# EAGLE schematic esp12_led (EAGLE 7.2.0)
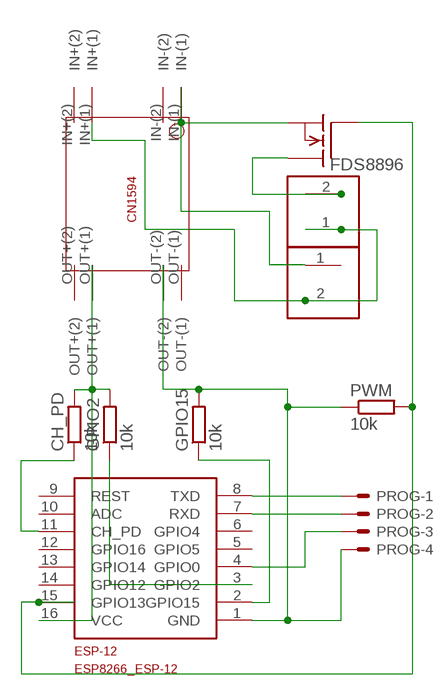
[diagram p0: schematic, sheet 1]

## Parts
12V_IN  KF350-P2  [KF350-2P]
CH_PD  10k  R-EU_R0603  [R0603]
DC_CONVERTER  CN1594THROUGH-HOLE  [CN1594]
ESP-12  ESP8266_ESP-12  [ESP8266-ESP12]
FDS8896  FDS5680  [SO-8]
GPIO2  10k  R-EU_R0603  [R0603]
GPIO15  10k  R-EU_R0603  [R0603]
LED  KF350-P2  [KF350-2P]
PROG  87438-04  [87438-04]
PWM  10k  R-EU_R0603  [R0603]

## Nets
N$1: CH_PD.2 DC_CONVERTER.OUT+(1) ESP-12.16(VCC) GPIO2.2
N$2: CH_PD.1 ESP-12.11(CH_PD)
N$3: ESP-12.3(GPIO2) GPIO2.1
N$4: FDS8896.5(D) FDS8896.6(D) FDS8896.7(D) FDS8896.8(D) LED.2
N$5: ESP-12.8(TXD) PROG.1
N$6: DC_CONVERTER.OUT-(2) ESP-12.1(GND) GPIO15.2 PROG.4 PWM.1
N$7: ESP-12.2(GPIO15) GPIO15.1
N$8: ESP-12.7(RXD) PROG.2
N$9: ESP-12.4(GPIO0) PROG.3
N$10: 12V_IN.1 DC_CONVERTER.IN-(1) FDS8896.1(S) FDS8896.2(S) FDS8896.3(S)
N$12: 12V_IN.2 DC_CONVERTER.IN+(1) LED.1
N$13: ESP-12.15(GPIO13) FDS8896.4(G) PWM.2
Unconnected: DC_CONVERTER.IN+(2) DC_CONVERTER.IN-(2) DC_CONVERTER.OUT+(2) DC_CONVERTER.OUT-(1) ESP-12.5(GPIO5) ESP-12.6(GPIO4) ESP-12.9(REST) ESP-12.10(ADC) ESP-12.12(GPIO16) ESP-12.13(GPIO14) ESP-12.14(GPIO12)

## Library data of the parts
12V_IN LED = KF350-P2:KF350-P2
CH_PD GPIO2 GPIO15 PWM = rcl:R-EU_: RESISTOR, European symbol
DC_CONVERTER = CN1594_smd:CN1594
ESP-12 = ESP8266-ESP12:ESP8266_ESP-12
FDS8896 = transistor-fet:FDS5680: 60V N-Channel PowerTrench TM MOSFET FAIRCHILD FDS5680.pdf
PROG = con-molex:87438-04: Wire-to-Board 1.50mm (.059") Pitch Header - Right Angle, SMT, Shrouded Source: http://www.molex.com/product/micro/87438.html; OC_FARNELL: unknown; OC_NEWARK: unknown